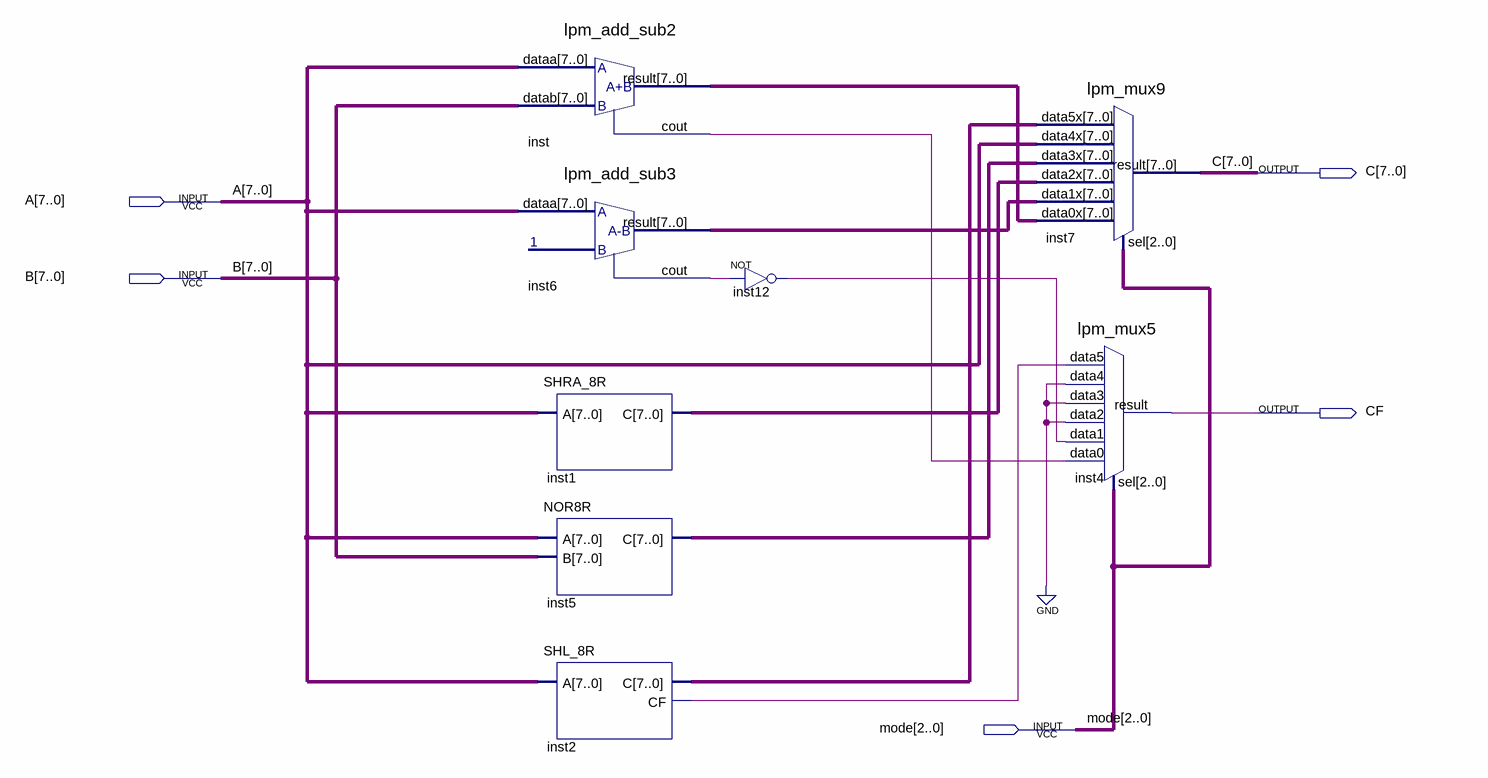
[diagram p0: schematic sheet]
// Quartus schematic ALU.bdf as structural Verilog: 8 symbols, 5 pins
module ALU (
  input  [7:0] A,
  input  [7:0] B,
  input  [2:0] mode,
  output [7:0] C,
  output CF
);

  wire inst2_cf, inst6_cout, inst12_out, inst_cout;
  wire [7:0] inst1_c, inst2_c, inst5_c, inst6_result, inst_result;

  lpm_add_sub2 inst (.dataa(A), .datab(B), .result(inst_result), .cout(inst_cout));
  lpm_add_sub3 inst6 (.dataa(A), .result(inst6_result), .cout(inst6_cout));
  SHRA_8R inst1 (.A(A), .C(inst1_c));
  NOR8R inst5 (.A(A), .B(B), .C(inst5_c));
  SHL_8R inst2 (.A(A), .C(inst2_c), .CF(inst2_cf));
  not inst12 (inst12_out, inst6_cout);
  lpm_mux9 inst7 (
    .data5x(inst2_c), .data4x(A), .data3x(inst5_c), .data2x(inst1_c), .data1x(inst6_result),
    .data0x(inst_result), .sel(mode), .result(C));
  lpm_mux5 inst4 (
    .data5(inst2_cf), .data4(1'b0), .data3(1'b0), .data2(1'b0), .data1(inst12_out), .data0(inst_cout),
    .sel(mode), .result(CF));
endmodule
